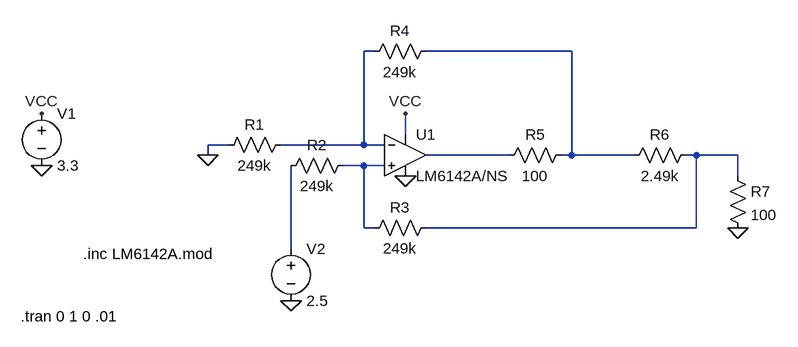
[diagram p0: schematic Current_Source.asc]
Current_Source.asc, the LTspice schematic file:
Version 4
SHEET 1 1156 680
WIRE 528 80 512 80
WIRE 832 80 608 80
WIRE 576 208 576 176
WIRE 304 224 272 224
WIRE 512 224 512 80
WIRE 512 224 384 224
WIRE 544 224 512 224
WIRE 272 240 272 224
WIRE 736 240 608 240
WIRE 832 240 832 80
WIRE 832 240 816 240
WIRE 928 240 832 240
WIRE 1024 240 1008 240
WIRE 1088 240 1024 240
WIRE 512 256 480 256
WIRE 544 256 512 256
WIRE 1088 272 1088 240
WIRE 512 352 512 256
WIRE 528 352 512 352
WIRE 1024 352 1024 240
WIRE 1024 352 608 352
WIRE 400 384 400 256
FLAG 16 256 0
FLAG 400 464 0
FLAG 272 240 0
FLAG 576 272 0
FLAG 16 176 VCC
FLAG 576 176 VCC
FLAG 1088 352 0
SYMBOL voltage 16 160 R0
WINDOW 123 0 0 Left 2
WINDOW 39 0 0 Left 2
SYMATTR Value2 ""
SYMATTR SpiceLine ""
SYMATTR InstName V1
SYMATTR Value 3.3
SYMBOL voltage 400 368 R0
WINDOW 123 0 0 Left 2
WINDOW 39 0 0 Left 2
SYMATTR Value2 ""
SYMATTR SpiceLine ""
SYMATTR InstName V2
SYMATTR Value 2.5
SYMBOL Opamps\\opamp2 576 176 R0
SYMATTR InstName U1
SYMATTR Value LM6142A/NS
SYMBOL res 400 208 R90
WINDOW 0 0 56 VBottom 2
WINDOW 3 32 56 VTop 2
SYMATTR InstName R1
SYMATTR Value 249k
SYMBOL res 496 240 R90
WINDOW 0 0 56 VBottom 2
WINDOW 3 32 56 VTop 2
SYMATTR InstName R2
SYMATTR Value 249k
SYMBOL res 624 336 R90
WINDOW 0 0 56 VBottom 2
WINDOW 3 32 56 VTop 2
SYMATTR InstName R3
SYMATTR Value 249k
SYMBOL res 624 64 R90
WINDOW 0 0 56 VBottom 2
WINDOW 3 32 56 VTop 2
SYMATTR InstName R4
SYMATTR Value 249k
SYMBOL res 832 224 R90
WINDOW 0 0 56 VBottom 2
WINDOW 3 32 56 VTop 2
SYMATTR InstName R5
SYMATTR Value 100
SYMBOL res 1024 224 R90
WINDOW 0 0 56 VBottom 2
WINDOW 3 32 56 VTop 2
SYMATTR InstName R6
SYMATTR Value 2.49k
SYMBOL res 1072 256 R0
SYMATTR InstName R7
SYMATTR Value 100
TEXT 80 392 Left 2 !.inc LM6142A.mod
TEXT -16 488 Left 2 !.tran 0 1 0 .01

The netlist it stands for:
* Current_Source.asc
V1 VCC 0 3.3
V2 N006 0 2.5
XU1 N005 N001 VCC 0 N003 LM6142A/NS  ; pins In+ In- V+ V- OUT
R1 N001 0 249k
R2 N005 N006 249k
R3 N004 N005 249k
R4 N002 N001 249k
R5 N002 N003 100
R6 N004 N002 2.49k
R7 N004 0 100
.inc LM6142A.mod
.tran 0 1 0 .01
.backanno
.end